# EAGLE design NeoDigito Big V2_1 PCBWay (EAGLE 9.6.2)
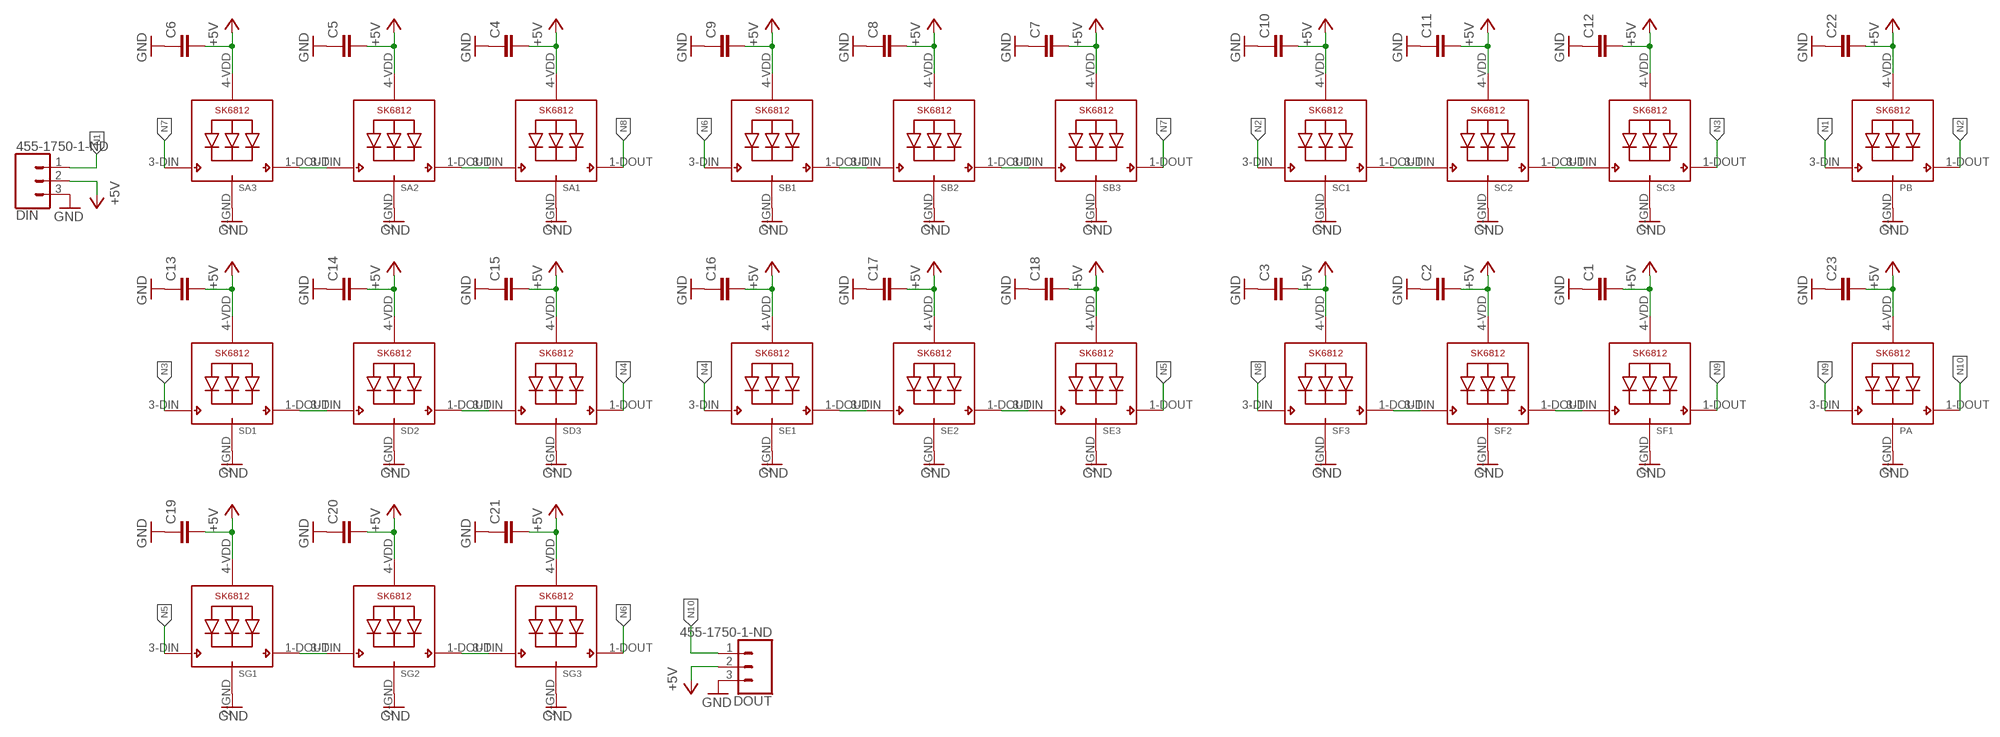
[diagram p0: schematic, sheet 1]

## Parts
C1  C-EUC0805  [C0805]
C2  C-EUC0805  [C0805]
C3  C-EUC0805  [C0805]
C4  C-EUC0805  [C0805]
C5  C-EUC0805  [C0805]
C6  C-EUC0805  [C0805]
C7  C-EUC0805  [C0805]
C8  C-EUC0805  [C0805]
C9  C-EUC0805  [C0805]
C10  C-EUC0805  [C0805]
C11  C-EUC0805  [C0805]
C12  C-EUC0805  [C0805]
C13  C-EUC0805  [C0805]
C14  C-EUC0805  [C0805]
C15  C-EUC0805  [C0805]
C16  C-EUC0805  [C0805]
C17  C-EUC0805  [C0805]
C18  C-EUC0805  [C0805]
C19  C-EUC0805  [C0805]
C20  C-EUC0805  [C0805]
C21  C-EUC0805  [C0805]
C22  C-EUC0805  [C0805]
C23  C-EUC0805  [C0805]
DIN  455-1750-1-ND  CONN_03  [1X03]
DOUT  455-1750-1-ND  CONN_031X03_NO_SILK  [1X03_NO_SILK]
PA  SK6812_3535  [LED3535]
PB  SK6812_3535  [LED3535]
SA1  SK6812_3535  [LED3535]
SA2  SK6812_3535  [LED3535]
SA3  SK6812_3535  [LED3535]
SB1  SK6812_3535  [LED3535]
SB2  SK6812_3535  [LED3535]
SB3  SK6812_3535  [LED3535]
SC1  SK6812_3535  [LED3535]
SC2  SK6812_3535  [LED3535]
SC3  SK6812_3535  [LED3535]
SD1  SK6812_3535  [LED3535]
SD2  SK6812_3535  [LED3535]
SD3  SK6812_3535  [LED3535]
SE1  SK6812_3535  [LED3535]
SE2  SK6812_3535  [LED3535]
SE3  SK6812_3535  [LED3535]
SF1  SK6812_3535  [LED3535]
SF2  SK6812_3535  [LED3535]
SF3  SK6812_3535  [LED3535]
SG1  SK6812_3535  [LED3535]
SG2  SK6812_3535  [LED3535]
SG3  SK6812_3535  [LED3535]

## Nets
+5V: C1.2 C2.2 C3.2 C4.2 C5.2 C6.2 C7.2 C8.2 C9.2 C10.2 C11.2 C12.2 C13.2 C14.2 C15.2 C16.2 C17.2 C18.2 C19.2 C20.2 C21.2 C22.2 C23.2 DIN.2 DOUT.2 PA.4-VDD(VDD) PB.4-VDD(VDD) SA1.4-VDD(VDD) SA2.4-VDD(VDD) SA3.4-VDD(VDD) SB1.4-VDD(VDD) SB2.4-VDD(VDD) SB3.4-VDD(VDD) SC1.4-VDD(VDD) SC2.4-VDD(VDD) SC3.4-VDD(VDD) SD1.4-VDD(VDD) SD2.4-VDD(VDD) SD3.4-VDD(VDD) SE1.4-VDD(VDD) SE2.4-VDD(VDD) SE3.4-VDD(VDD) SF1.4-VDD(VDD) SF2.4-VDD(VDD) SF3.4-VDD(VDD) SG1.4-VDD(VDD) SG2.4-VDD(VDD) SG3.4-VDD(VDD)
GND: C1.1 C2.1 C3.1 C4.1 C5.1 C6.1 C7.1 C8.1 C9.1 C10.1 C11.1 C12.1 C13.1 C14.1 C15.1 C16.1 C17.1 C18.1 C19.1 C20.1 C21.1 C22.1 C23.1 DIN.3 DOUT.3 PA.2-GND(GND) PB.2-GND(GND) SA1.2-GND(GND) SA2.2-GND(GND) SA3.2-GND(GND) SB1.2-GND(GND) SB2.2-GND(GND) SB3.2-GND(GND) SC1.2-GND(GND) SC2.2-GND(GND) SC3.2-GND(GND) SD1.2-GND(GND) SD2.2-GND(GND) SD3.2-GND(GND) SE1.2-GND(GND) SE2.2-GND(GND) SE3.2-GND(GND) SF1.2-GND(GND) SF2.2-GND(GND) SF3.2-GND(GND) SG1.2-GND(GND) SG2.2-GND(GND) SG3.2-GND(GND)
N1: DIN.1 PB.3-DIN(DI)
N2: PB.1-DOUT(DO) SC1.3-DIN(DI)
N3: SC3.1-DOUT(DO) SD1.3-DIN(DI)
N4: SD3.1-DOUT(DO) SE1.3-DIN(DI)
N5: SE3.1-DOUT(DO) SG1.3-DIN(DI)
N6: SB1.3-DIN(DI) SG3.1-DOUT(DO)
N7: SA3.3-DIN(DI) SB3.1-DOUT(DO)
N8: SA1.1-DOUT(DO) SF3.3-DIN(DI)
N9: PA.3-DIN(DI) SF1.1-DOUT(DO)
N10: DOUT.1 PA.1-DOUT(DO)
N$2: SA2.3-DIN(DI) SA3.1-DOUT(DO)
N$3: SA1.3-DIN(DI) SA2.1-DOUT(DO)
N$5: SB1.1-DOUT(DO) SB2.3-DIN(DI)
N$6: SB2.1-DOUT(DO) SB3.3-DIN(DI)
N$7: SC1.1-DOUT(DO) SC2.3-DIN(DI)
N$8: SC2.1-DOUT(DO) SC3.3-DIN(DI)
N$9: SD1.1-DOUT(DO) SD2.3-DIN(DI)
N$10: SD2.1-DOUT(DO) SD3.3-DIN(DI)
N$11: SG1.1-DOUT(DO) SG2.3-DIN(DI)
N$12: SG2.1-DOUT(DO) SG3.3-DIN(DI)
N$13: SE1.1-DOUT(DO) SE2.3-DIN(DI)
N$14: SE2.1-DOUT(DO) SE3.3-DIN(DI)
N$16: SF2.3-DIN(DI) SF3.1-DOUT(DO)
N$17: SF1.3-DIN(DI) SF2.1-DOUT(DO)

## Library data of the parts
C1-C23 = CCV1:C-EU: CAPACITOR, European symbol; SPICEPREFIX: C
DIN = CCV1:CONN_03: Multi connection point. Often used as Generic Header-pin footprint for 0.1 inch spaced/style header connections On any of the 0.1 inch spaced packages, you can populate with these: Break Away Headers - Straight <https://www.sparkfun.com/products/116> (PRT-00116) Break Away Male Headers - Right Angle <https://www.sparkfun.com/products/553> (PRT-00553) Female Headers <https://www.sparkfun.com/products/115> (PRT-00115) Break Away Headers - Machine Pin <https://www.sparkfun.com/products/117> (PRT-00117) Break Away Female Headers - Swiss Machine Pin <https://www.sparkfun.com/products/743> (PRT-00743) Stackable Header - 3 Pin (Female, 0.1") <https://www.sparkfun.com/products/13875> (PRT-13875) For SCREWTERMINALS and SPRING TERMINALS visit here: Screw Terimnals on SparkFun.com <https://www.sparkfun.com/search/results?term=Screw+Terminals> (5mm/3.5mm/2.54mm spacing) This device is also useful as a general connection point to wire up your design to another part of your project. Our various solder wires solder well into these plated through hole pads. Hook-Up Wire - Assortment (Stranded, 22 AWG) <https://www.sparkfun.com/products/11375> (PRT-11375) Hook-Up Wire - Assortment (Solid Core, 22 AWG) <https://www.sparkfun.com/products/11367> (PRT-11367) View the entire wire category on our website here <https://www.sparkfun.com/categories/141> Special notes: Molex polarized connector foot print use with SKU : PRT-08232 with associated crimp pins and housings.; PROD_ID: XXX-00000
DOUT = CCV1:CONN_03: Multi connection point. Often used as Generic Header-pin footprint for 0.1 inch spaced/style header connections On any of the 0.1 inch spaced packages, you can populate with these: Break Away Headers - Straight <https://www.sparkfun.com/products/116> (PRT-00116) Break Away Male Headers - Right Angle <https://www.sparkfun.com/products/553> (PRT-00553) Female Headers <https://www.sparkfun.com/products/115> (PRT-00115) Break Away Headers - Machine Pin <https://www.sparkfun.com/products/117> (PRT-00117) Break Away Female Headers - Swiss Machine Pin <https://www.sparkfun.com/products/743> (PRT-00743) Stackable Header - 3 Pin (Female, 0.1") <https://www.sparkfun.com/products/13875> (PRT-13875) For SCREWTERMINALS and SPRING TERMINALS visit here: Screw Terimnals on SparkFun.com <https://www.sparkfun.com/search/results?term=Screw+Terminals> (5mm/3.5mm/2.54mm spacing) This device is also useful as a general connection point to wire up your design to another part of your project. Our various solder wires solder well into these plated through hole pads. Hook-Up Wire - Assortment (Stranded, 22 AWG) <https://www.sparkfun.com/products/11375> (PRT-11375) Hook-Up Wire - Assortment (Solid Core, 22 AWG) <https://www.sparkfun.com/products/11367> (PRT-11367) View the entire wire category on our website here <https://www.sparkfun.com/categories/141> Special notes: Molex polarized connector foot print use with SKU : PRT-08232 with associated crimp pins and housings.
PA PB SA1-SA3 SB1-SB3 SC1-SC3 SD1-SD3 SE1-SE3 SF1-SF3 SG1-SG3 = CCV1:SK6812

## Board
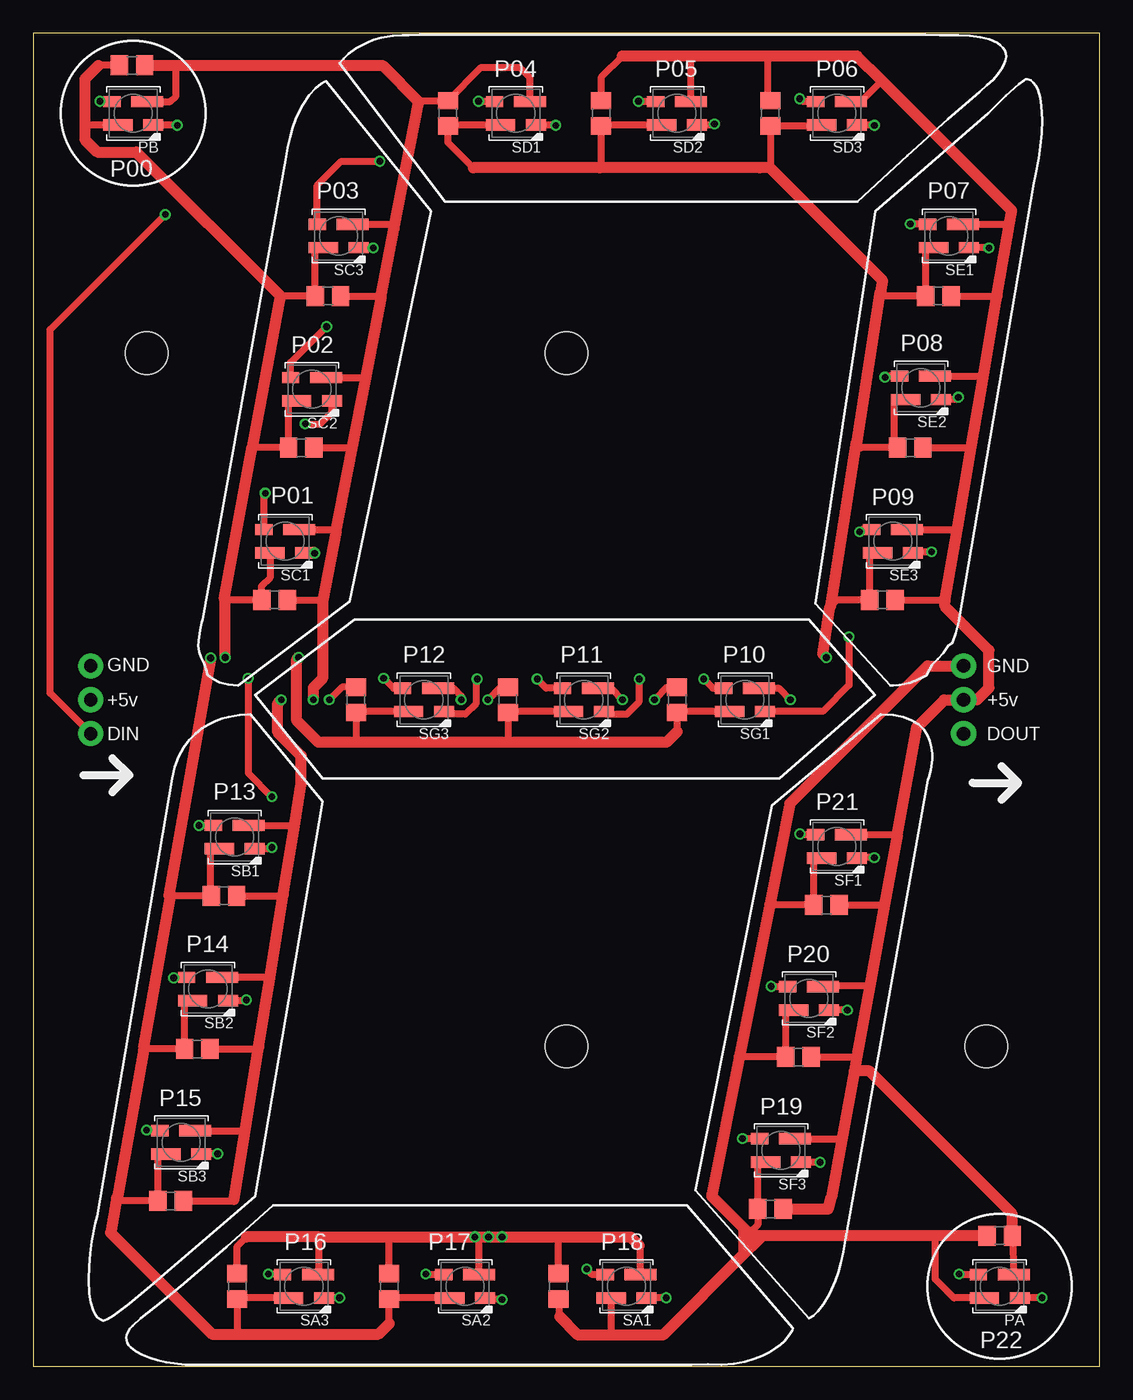
[diagram p1: board, top side]
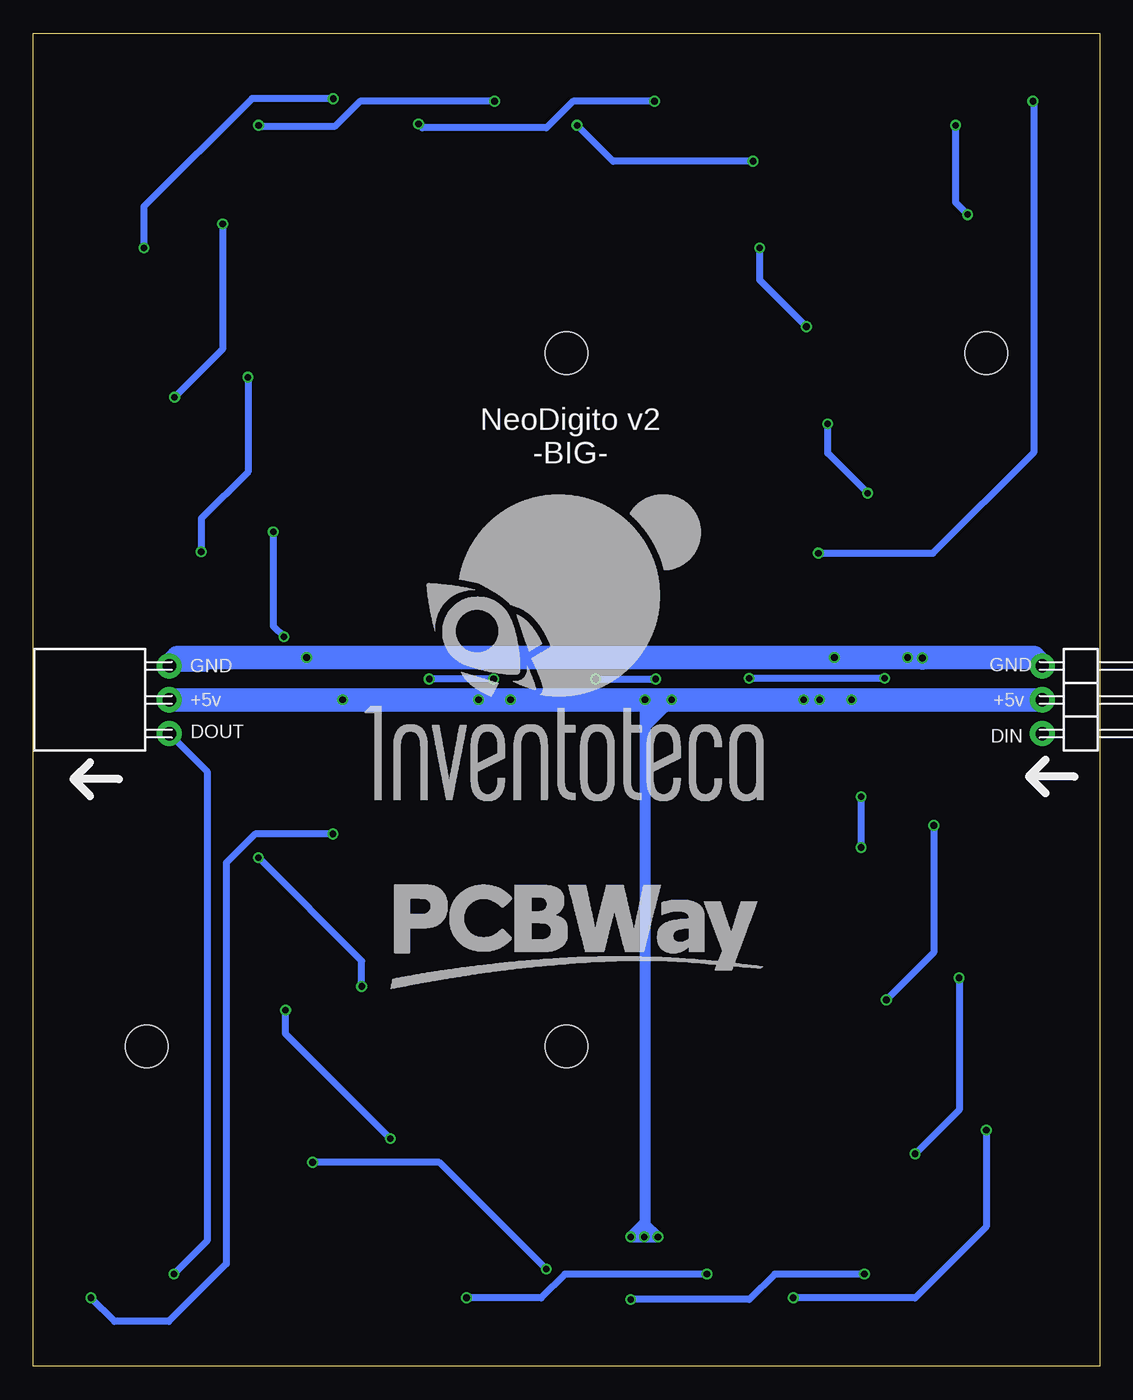
[diagram p2: board, bottom side, seen from below]

Size 80 x 100 mm. Coordinates in mm from the lower left corner, seen from the top.
Outline: 80,100 0,100 0,0 80,0 80,100
Copper layers (1*16): Top 0.035mm / dielectric 1.5mm / Bottom 0.035mm
Design rules "_xircuitos.mx_2L_DRC": minimum track width 6mil, minimum drill 12mil, track to track 6mil, track to pad 6mil, pad to pad 6mil, via to via 6mil, smd to smd 0mil, copper to edge 10mil, drill to drill 12mil, minimum pad ring 10mil, minimum via ring 6mil, stop-mask expansion 2mil, vias tented up to drill 100mil, thermal gap 10mil
Holes 3.2 mm at 40,24 40,76 8.5,76 71.5,24

### Footprints (pad centres in the part's own frame; a part is rotated, then mirrored left to right if it is on the bottom)
C0805 = smd 1.3 x 1.5: 1 -0.95,0; 2 0.95,0
1X03 = drill 1 pad 1.88: 1 -2.54,0; 2 0,0; 3 2.54,0
1X03_NO_SILK = drill 1.016 pad 1.88: 1 -2.54,0; 2 0,0; 3 2.54,0
LED3535 = smd 1.3 x 0.85: 1-DOUT 1.6,-0.875 | smd 2.2 x 0.85: 2-GND 1.15,0.875 | smd 1.5 x 0.85: 3-DIN -1.5,0.875 | smd 2.4 x 0.85: 4-VDD -1.05,-0.875

### Placement (x,y rotation side)
C1  59.5,34.6 0 top
C2  57.4,23.2 0 top
C3  55.3,11.8 0 top
C4  39.4,6 90 top
C5  26.7,6 90 top
C6  15.3,6 90 top
C7  10.3,12.4 0 top
C8  12.3,23.8 0 top
C9  14.3,35.3 0 top
C10  18.1,57.5 0 top
C11  20.1,68.9 0 top
C12  22.1,80.3 0 top
C13  31.1,94 90 top
C14  42.6,94 90 top
C15  55.3,94 90 top
C16  67.9,80.3 0 top
C17  65.8,68.9 0 top
C18  63.7,57.5 0 top
C19  48.3,50 90 top
C20  35.6,50 90 top
C21  24.2,50 90 top
C22  7.4,97.6 0 top
C23  72.5,9.8 0 top
DIN  4.3,50 90 bottom
DOUT  69.8,50 90 bottom
PA  72.5,6 180 top
PB  7.5,94 180 top
SA1  44.5,6 180 top
SA2  32.4,6 180 top
SA3  20.3,6 180 top
SB1  15.1,39.7 180 top
SB2  13.1,28.3 180 top
SB3  11.1,16.8 180 top
SC1  18.9,61.9 180 top
SC2  20.9,73.3 180 top
SC3  22.9,84.8 180 top
SD1  36.2,94 180 top
SD2  48.3,94 180 top
SD3  60.3,94 180 top
SE1  68.7,84.8 180 top
SE2  66.6,73.4 180 top
SE3  64.5,61.9 180 top
SF1  60.3,39 180 top
SF2  58.2,27.6 180 top
SF3  56.1,16.2 180 top
SG1  53.4,50 180 top
SG2  41.3,50 180 top
SG3  29.3,50 180 top

### Tracks (layer width: path | path; a pad name or v marks a point on that pad's centre or on a via)
+5V  (via drill 0.5)
  Top 0.508: PB.4-VDD 10.28,94.88 10.7,95.3 10.7,97.5 10.8,97.6 | C12.2 26.08,80.3 26.1,80.28 26.12,80.26 | SC2.4-VDD 24.74,74.17 24.91,74 | SC1.4-VDD 22.6,62.77 22.71,62.67 22.72,62.66 | C11.2 23.81,68.9 23.91,68.8 | C10.2 21.62,57.5 21.69,57.42 | 28.9,94.8 28.95,94.85 29.05,94.95 C13.2 33.55,97.4 36.5,97.4 37.25,96.65 SD1.4-VDD | SC3.4-VDD 26.77,85.67 27.08,85.37 | 44.2,98.3 42.6,96.7 C14.2 | C15.2 55.1,95.15 55.1,98.3 | SD3.4-VDD 62.08,94.88 63.65,96.45 | SD2.4-VDD 49.35,98.15 49.2,98.3 | SE1.4-VDD 73.21,85.67 73.22,85.66 | SE2.4-VDD 71.22,74.28 71.27,74.22 | SE3.4-VDD 69.31,62.77 69.32,62.78 | C18.2 68.3,57.5 68.4,57.4 | C16.2 72.27,80.3 72.3,80.27 | C17.2 70.29,68.9 70.38,68.99 | C21.2 23.15,50.95 v22.2,50 | C20.2 35.06,50.95 v34.11,50 | C19.2 47.55,50.95 v46.6,50 | SG1.4-VDD 55.92,50.88 v56.8,50 | SG2.4-VDD 43.33,50.88 v44.2,50 | SG3.4-VDD 31.52,50.88 32.1,50.3 v32.1,50 | C6.2 15.3,9 16,9.7 | C9.2 18.69,35.3 18.75,35.36 | C8.2 16.77,23.8 16.91,23.94 | C7.2 14.96,12.4 15.06,12.5 | SB3.4-VDD 15.57,17.68 15.85,17.39 | SB2.4-VDD 14.2,29.22 17.76,29.22 | SB1.4-VDD 19.57,40.58 19.59,40.56 | SA3.4-VDD 21.45,6.98 21.45,9.7 | v33.14,9.7 33.45,9.39 SA2.4-VDD | SA1.4-VDD 45.55,8.97 45.46,9.07 | C4.2 39.4,9.61 39.49,9.7 | C5.2 26.7,9.66 26.66,9.7 | C2.2 61.73,23.2 61.81,23.27 | C1.2 63.85,34.6 63.87,34.62 | SF1.4-VDD 61.37,39.89 64.83,39.89 | SF2.4-VDD 59.35,28.57 62.77,28.57 | SF3.4-VDD 60.63,17.07 60.67,17.03 | C23.2 PA.4-VDD
  Top 0.813: 22.71,62.67 21.69,57.42 21.69,51.58 21,50.89 v21,50 | 22.72,62.66 23.91,68.8 24.91,74 26.12,80.26 | 26.1,80.28 27.08,85.37 28.9,94.8 | C22.2 10.8,97.6 26.2,97.6 28.95,94.85 | 44.2,98.3 49.2,98.3 55.1,98.3 61.8,98.3 63.65,96.45 73.4,86.7 73.22,85.66 72.3,80.27 71.27,74.22 70.38,68.99 69.32,62.78 68.4,57.4 68.4,57 71.7,53.7 71.7,50.9 70.8,50 DOUT.2 68.35,50 66.28,47.93 64.83,39.89 63.87,34.62 62.77,28.57 61.81,23.27 61.6,22.15 | 16,9.7 21.45,9.7 26.66,9.7 v33.14,9.7 v34.15,9.7 v35.17,9.7 39.49,9.7 44.82,9.7 45.46,9.07 | 15.06,12.5 15.85,17.39 16.91,23.94 17.76,29.22 18.75,35.36 19.59,40.56 20.1,43.7 20.1,45.8 18.35,47.55 18.35,49.75 v18.6,50 | 61.6,22.15 60.67,17.03 59.89,12.68 59.64,11.8 C3.2 | C23.2 73.45,11.43 62.73,22.15 61.6,22.15
  Bottom 0.813: 34.11,10.76 34.17,10.7 | 34.17,10.7 33.18,9.7 | v33.14,9.7 33.18,9.7 | 34.11,10.76 34.11,9.74 v34.15,9.7 | v34.11,50 34.11,47.99 | 34.11,47.99 34.11,10.76 | 33.18,9.7 v35.17,9.7 34.17,10.7 | v32.1,50 33.46,48.64 | 33.46,48.64 34.11,47.99 | 33.26,50 33.46,49.8 33.46,48.64
  Bottom 1.778: DIN.2 v18.6,50 v21,50 v22.2,50 v32.1,50 33.26,50 v34.11,50 v44.2,50 v46.6,50 v56.8,50 DOUT.2
GND  (via drill 0.5)
  Top 0.508: C22.1 4.9,97.6 | PB.2-GND 6.33,93.1 3.87,93.1 | SD3.2-GND 59.08,93.05 C15.1 55.3,90 55.2,89.9 54.51,89.9 | SD2.2-GND 42.67,93.12 C14.1 42.6,90 42.5,89.9 | SD1.2-GND 31.18,93.12 C13.1 31.1,91.8 33,89.9 | SG1.2-GND 48.38,49.12 C19.1 48.3,47.6 | SG2.2-GND 35.67,49.12 C20.1 35.6,46.9 35.7,46.8 | SG3.2-GND 24.27,49.12 C21.1 24.2,46.8 | 18.52,80.31 18.52,80.3 C12.1 21.15,83.65 21.1,83.7 21.32,83.92 SC3.2-GND | 16.43,68.96 16.49,68.9 C11.1 19.15,72.35 19.23,72.42 SC2.2-GND | SC1.2-GND 17.75,59.15 17.11,58.51 17.11,57.45 C10.1 14.36,57.5 14.33,57.53 | 63.57,80.6 63.59,80.58 63.87,80.3 C16.1 66.95,83.75 66.9,83.8 67.03,83.92 SE1.2-GND | 61.75,69.28 61.79,69.24 62.13,68.9 C17.1 64.6,69.15 64.6,72.5 65.42,72.5 SE2.2-GND | SE3.2-GND 62.92,61.02 62.7,60.8 62.75,60.75 C18.1 60.3,57.5 59.83,57.03 59.78,56.98 | 26.7,3.2 C5.1 26.77,5.12 SA2.2-GND | C6.1 15.3,5 | 15.3,5 15.3,2.6 15.5,2.4 | SA3.2-GND 15.43,5.12 15.3,5 | 6.25,12.63 6.3,12.57 6.47,12.4 C7.1 9.35,15.85 9.3,15.9 9.32,15.93 SB3.2-GND | 8.27,23.73 8.26,23.73 | 10.16,35.3 10.3,35.3 C9.1 13.3,35.35 13.3,38.8 13.93,38.8 SB1.2-GND | SB2.2-GND 11.53,27.43 11.3,27.2 11.35,27.15 C8.1 8.34,23.8 8.27,23.73 | 8.29,23.85 8.27,23.83 8.27,23.73 | 14.36,53.22 v14.4,53.17 | 39.49,3.73 39.49,4.96 C4.1 | SA1.2-GND 43.35,2.64 43.04,2.34 43.3,2.34 | 52.98,23.23 53.02,23.2 C2.1 56.45,26.52 56.38,26.59 56.51,26.73 SF2.2-GND | 55.25,34.64 55.29,34.6 C1.1 58.55,38.01 58.54,38.02 58.64,38.12 SF1.2-GND | SF3.2-GND 54.25,15.32 54.22,15.29 54.35,15.16 C3.1 54.35,10.6 53.71,9.96 | PA.2-GND 69.08,5.12 67.68,6.53 67.68,9.8
  Top 0.813: 4.9,97.6 3.87,96.57 3.87,93.1 3.87,92.03 4.8,91.1 7.73,91.1 18.52,80.31 | 48.3,47.6 47.5,46.8 35.7,46.8 24.2,46.8 21.4,46.8 19.77,48.43 19.77,53.05 v19.9,53.17 | 14.33,57.53 16.43,68.96 | 18.52,80.3 16.43,68.96 | 59.78,56.98 59.23,53.45 v59.5,53.17 | 59.83,57.03 61.75,69.28 | 61.79,69.24 63.57,80.6 | 63.59,80.58 63.73,81.44 55.27,89.9 54.51,89.9 42.5,89.9 33,89.9 | v13.3,53.13 10.16,35.3 | 8.29,23.85 10.3,35.3 | 8.26,23.73 6.3,12.57 | 6.25,12.63 5.79,10.01 13.4,2.4 15.5,2.4 25.9,2.4 26.7,3.2 | 14.36,57.5 14.36,53.22 | C23.1 67.68,9.8 54.7,9.8 | 54.7,9.8 54.28,9.39 | 54.28,9.39 53.33,8.43 | 53.33,8.43 47.23,2.34 43.3,2.34 40.88,2.34 39.49,3.73 | 53.33,10.34 50.92,12.75 50.92,12.88 52.98,23.23 55.25,34.64 56.76,42.22 67.08,52.54 DOUT.3 | 53.33,10.34 53.71,9.96 53.87,9.8 | 53.87,9.8 54.28,9.39 | 53.33,8.43 53.33,10.34 | 54.7,9.8 53.87,9.8
  Bottom 0.813: DOUT.3 67.08,52.54
  Bottom 1.778: 13.26,53.17 v14.4,53.17 v19.9,53.17 v59.5,53.17 69.17,53.17 DOUT.3 | 13.26,53.17 4.93,53.17 DIN.3 | v13.3,53.13 13.26,53.17
N1  (via drill 0.5)
  Top 0.508: DIN.1 1.26,50.5 1.26,77.78 9.88,86.4 v9.9,86.4 | v10.8,93.1 10.78,93.12 PB.3-DIN
  Bottom 0.508: v9.9,86.4 10.8,87.3 v10.8,93.1
N2  (via drill 0.5)
  Top 0.508: SC1.3-DIN 21.07,61.02 v21.1,61 | v5,94.9 5.03,94.88 PB.1-DOUT
  Bottom 0.508: v21.1,61 12.5,61 4.9,68.6 4.9,94.8 v5,94.9
N3  (via drill 0.5)
  Top 0.508: SC3.1-DOUT 21.3,88.6 23.1,90.4 v26,90.4 | v39.2,93.1 37.73,93.1 SD1.3-DIN
  Bottom 0.508: v26,90.4 36.5,90.4 v39.2,93.1
N4  (via drill 0.5)
  Top 0.508: SD3.1-DOUT 57.73,94.88 v57.5,95.1 | v71.7,83.9 70.22,83.9 SE1.3-DIN
  Bottom 0.508: v57.5,95.1 63.6,95.1 71.7,87 v71.7,83.9
N5  (via drill 0.5)
  Top 0.508: SE3.1-DOUT 62.17,62.77 v62,62.6 | v61.2,54.73 61.2,51.1 59.23,49.12 SG1.3-DIN
  Bottom 0.508: v62,62.6 62,55.53 v61.2,54.73
N6  (via drill 0.5)
  Top 0.508: SG3.1-DOUT 27.02,50.88 v26.28,51.61 | v16.12,51.61 16.12,44.5 v17.9,42.72 | v17.9,38.91 17.81,38.83 SB1.3-DIN
  Bottom 0.508: v26.28,51.61 v16.12,51.61 | v17.9,42.72 v17.9,38.91
N7  (via drill 0.5)
  Top 0.508: SB3.1-DOUT 8.53,17.68 v8.5,17.7 | v22.98,5.13 v22.97,5.12 SA3.3-DIN
  Bottom 0.508: v8.5,17.7 8.5,10.46 13.83,5.13 v22.98,5.13
N8  (via drill 0.5)
  Top 0.508: SA1.1-DOUT 41.93,6.88 v41.52,7.29 | v59.05,15.29 57.63,15.29 SF3.3-DIN
  Bottom 0.508: v41.52,7.29 49.52,15.29 v59.05,15.29
N9  (via drill 0.5)
  Top 0.508: SF1.1-DOUT 57.58,39.88 v57.52,39.93 | v75.68,5.13 v75.68,5.12 PA.3-DIN
  Bottom 0.508: v57.52,39.93 63.36,39.93 65.52,37.77 65.52,7.67 69.84,3.35 73.9,3.35 v75.68,5.13
N10  (via drill 0.5)
  Top 0.508: PA.1-DOUT 69.49,6.88 v69.46,6.91
  Bottom 0.508: v69.46,6.91 66.92,9.45 66.92,44.58 DOUT.1
N$2  (via drill 0.5)
  Top 0.508: SA3.1-DOUT 18.67,6.91 v17.64,6.91 | v35.17,5 34.02,5 SA2.3-DIN
  Bottom 0.508: v17.64,6.91 24.37,6.91 26.28,5 v35.17,5
N$3  (via drill 0.5)
  Top 0.508: SA2.1-DOUT 29.49,6.88 v29.45,6.91 | v47.49,5.13 v47.48,5.12 SA1.3-DIN
  Bottom 0.508: v29.45,6.91 40.12,6.91 41.9,5.13 v47.49,5.13
N$5  (via drill 0.5)
  Top 0.508: SB1.1-DOUT 12.45,40.58 v12.44,40.56 | v15.99,27.48 15.93,27.43 SB2.3-DIN
  Bottom 0.508: v12.44,40.56 12.44,31.04 v15.99,27.48
N$6  (via drill 0.5)
  Top 0.508: SB2.1-DOUT 10.57,29.18 v10.53,29.13 | v13.83,15.93 SB3.3-DIN
  Bottom 0.508: v10.53,29.13 10.53,19.23 v13.83,15.93
N$7  (via drill 0.5)
  Top 0.508: SC1.1-DOUT 17.3,65.4 v17.4,65.5 | v20.4,70.7 21.5,70.7 22.4,71.6 SC2.3-DIN
  Bottom 0.508: v17.4,65.5 20.4,68.5 v20.4,70.7
N$8  (via drill 0.5)
  Top 0.508: SC2.1-DOUT 19.3,75.3 v22,78 | v25.5,83.9 24.43,83.9 SC3.3-DIN
  Bottom 0.508: v22,78 25.5,81.5 v25.5,83.9
N$9  (via drill 0.5)
  Top 0.508: SD1.1-DOUT 33.42,94.88 v33.4,94.9 | v51.1,93.2 51.02,93.12 SD2.3-DIN
  Bottom 0.508: v33.4,94.9 39.5,94.9 41.5,92.9 50.8,92.9 v51.1,93.2
N$10  (via drill 0.5)
  Top 0.508: SD2.1-DOUT 45.42,94.88 v45.4,94.9 | v63.1,93.1 63.08,93.12 SD3.3-DIN
  Bottom 0.508: v45.4,94.9 55.5,94.9 57.4,93 63,93 v63.1,93.1
N$11  (via drill 0.5)
  Top 0.508: v50.3,51.55 50.98,50.88 SG1.1-DOUT | v45.47,51.55 45.47,49.87 44.52,48.92 43,48.92 SG2.3-DIN
  Bottom 0.508: v45.47,51.55 v50.3,51.55
N$12  (via drill 0.5)
  Top 0.508: SG2.1-DOUT 38.48,50.88 v37.8,51.55 | SG3.3-DIN 31,48.92 32.42,48.92 33.2,49.7 33.2,51.45 v33.3,51.55
  Bottom 0.508: v37.8,51.55 v33.3,51.55
N$13  (via drill 0.5)
  Top 0.508: SE1.1-DOUT 65.83,85.67 v65.8,85.7 | v69.4,72.7 69.22,72.53 SE2.3-DIN
  Bottom 0.508: v65.8,85.7 65.8,76.3 v69.4,72.7
N$14  (via drill 0.5)
  Top 0.508: SE2.1-DOUT 63.98,74.28 v63.9,74.2 | v67.4,61.1 66.08,61.1 SE3.3-DIN
  Bottom 0.508: v63.9,74.2 63.9,67.1 67.4,63.6 v67.4,61.1
N$16  (via drill 0.5)
  Top 0.508: SF3.1-DOUT v53.21,17.07 v53.2,17.07 | v61.08,26.72 SF2.3-DIN
  Bottom 0.508: v53.2,17.07 61.08,24.94 v61.08,26.72
N$17  (via drill 0.5)
  Top 0.508: SF2.1-DOUT 55.39,28.48 v55.36,28.5 | v63.11,38.15 61.83,38.15 SF1.3-DIN
  Bottom 0.508: v55.36,28.5 55.36,30.4 v63.11,38.15

### Text on the board
tPlace: P04 | P05 | P06 | P00 | P03 | P07 | P02 | P08 | P01 | P09 | P12 | P11 | P10 | GND | GND | +5v | +5v | DIN | DOUT | P13 | P21 | P14 | P20 | P15 | P19 | P16 | P17 | P18 | P22
bPlace: NeoDigito v2 / -BIG- | GND | GND | +5v | +5v
tDocu: D | C | E | G | F | B | A